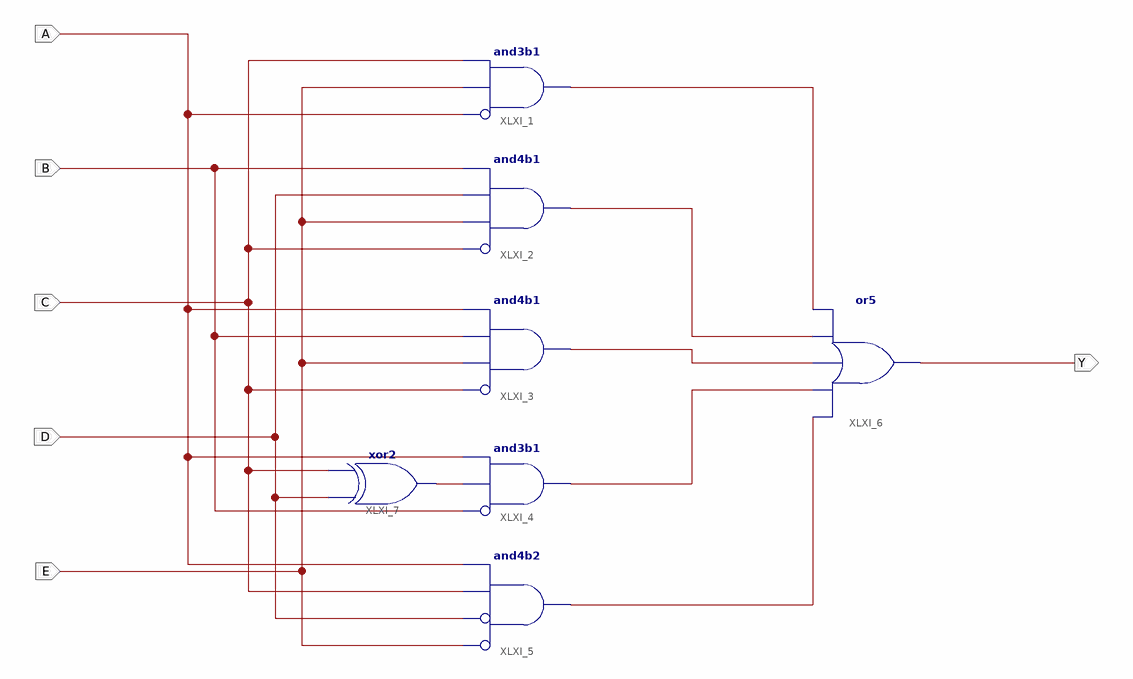
[diagram p0: schematic sheet 1]
// Xilinx ISE schematic funkcja2.sch (spartan3e) as structural Verilog: 7 symbols, 6 ports
module funkcja2 (
  input  A,
  input  B,
  input  C,
  input  D,
  input  E,
  output Y
);

  wire XLXN_15, XLXN_21, XLXN_22, XLXN_23, XLXN_24, XLXN_25;

  and XLXI_1 (XLXN_25, ~A, E, C);  // and3b1
  and XLXI_2 (XLXN_24, ~C, E, D, B);  // and4b1
  and XLXI_3 (XLXN_23, ~C, E, B, A);  // and4b1
  and XLXI_4 (XLXN_22, ~B, XLXN_15, A);  // and3b1
  and XLXI_5 (XLXN_21, ~E, ~D, C, A);  // and4b2
  or XLXI_6 (Y, XLXN_21, XLXN_22, XLXN_23, XLXN_24, XLXN_25);
  xor XLXI_7 (XLXN_15, D, C);
endmodule
